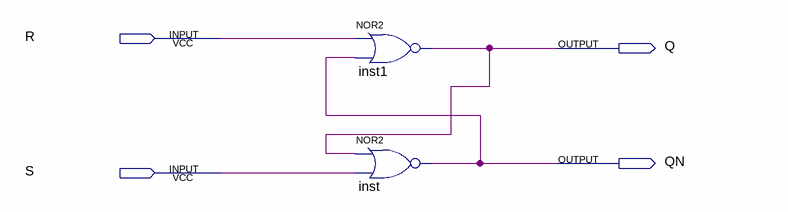
[diagram p0: schematic sheet]
// Quartus schematic lab9step1a.bdf as structural Verilog: 2 symbols, 4 pins
module lab9step1a (
  input  R,
  input  S,
  output Q,
  output QN
);

  nor inst1 (Q, R, QN);
  nor inst (QN, Q, S);
endmodule
